# Altium schematic sheet att_17db.SchDoc
size A4
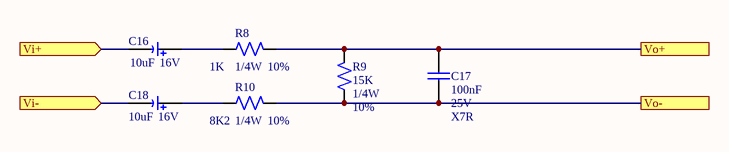
[diagram p0: att_17db.SchDoc]

## Parts
C16  Valor: 10uF  tension: 16V  [CAP_Electrolytic]  (hidden comment: Capacitor polarizado)
C17  valor: 100nF  tension: 25V  tolerancia: X7R  [C0805]  (hidden comment: Capacitor)
C18  Valor: 10uF  tension: 16V  [CAP_Electrolytic]  (hidden comment: Capacitor polarizado)
R8  Valor: 1K  Potencia: 1/4W  Tolerancia: 10%  [R0805]  (hidden comment: Resistor)
R9  Valor: 15K  Potencia: 1/4W  Tolerancia: 10%  [R0805]  (hidden comment: Resistor)
R10  Valor: 8K2  Potencia: 1/4W  Tolerancia: 10%  [R0805]  (hidden comment: Resistor)

## Ports
Vi+ (in), Vi- (in), Vo+, Vo-

## Nets
Vi+: C16.2 ; port Vi+
Vi-: C18.2 ; port Vi-
Vo+: C17.1 R8.2 R9.2 ; port Vo+
Vo-: C17.2 R9.1 R10.2 ; port Vo-
NetC16_1: C16.1 R8.1
NetC18_1: C18.1 R10.1

## Library data of the parts
C17 = Capacitor: Capacitor de placas paralelas; Encapsulado: 0805
R8-R10 = Resistor: Resistencia
C16 C18 = Capacitor polarizado: Link: *; Fabricante: *